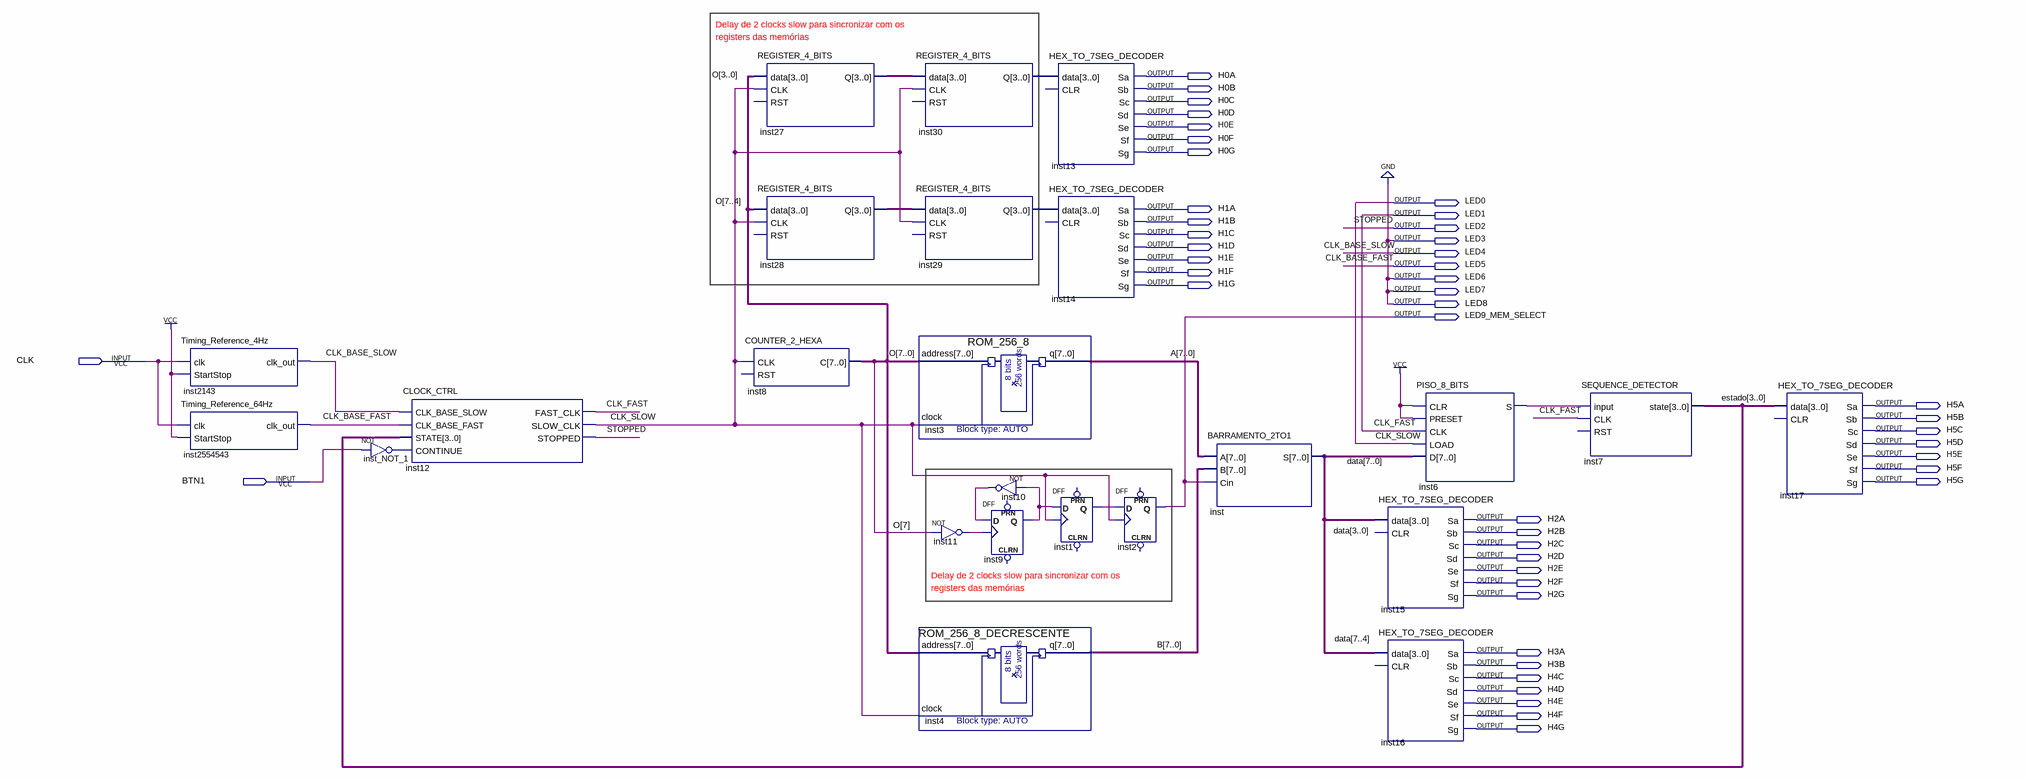
[diagram p0: schematic sheet]
// Quartus schematic main.bdf as structural Verilog: 24 symbols, 47 pins
module main (
  input  CLK,
  input  BTN1,
  output H0A,
  output H0B,
  output H0C,
  output H0D,
  output H0E,
  output H0F,
  output H0G,
  output LED0,
  output H1A,
  output LED1,
  output H1B,
  output LED2,
  output H1C,
  output LED3,
  output H1D,
  output LED4,
  output H1E,
  output LED5,
  output H1F,
  output LED6,
  output H1G,
  output LED7,
  output LED8,
  output LED9_MEM_SELECT,
  output H5A,
  output H5B,
  output H5C,
  output H5D,
  output H5E,
  output H5F,
  output H5G,
  output H2A,
  output H2B,
  output H2C,
  output H2D,
  output H2E,
  output H2F,
  output H2G,
  output H3A,
  output H3B,
  output H4C,
  output H4D,
  output H4E,
  output H4F,
  output H4G
);

  wire inst1_q, inst6_s, inst9_q, inst10_out, inst11_out, inst_NOT_1_out;
  wire [3:0] estado, inst27_q, inst28_q, inst29_q, inst30_q;
  wire [7:0] A, B, data, O;

  Timing_Reference_4Hz inst2143 (.clk(CLK), .StartStop(1'b1), .clk_out(LED4));
  Timing_Reference_64Hz inst2554543 (.clk(CLK), .StartStop(1'b1), .clk_out(LED5));
  CLOCK_CTRL inst12 (
    .CLK_BASE_SLOW(LED4), .CLK_BASE_FAST(LED5), .STATE(estado), .CONTINUE(inst_NOT_1_out), .FAST_CLK(LED1),
    .SLOW_CLK(LED0), .STOPPED(LED2));
  not inst_NOT_1 (inst_NOT_1_out, BTN1);
  REGISTER_4_BITS inst27 (.data(O[3:0]), .CLK(LED0), .Q(inst27_q));  // open: RST
  REGISTER_4_BITS inst28 (.data(O[7:4]), .CLK(LED0), .Q(inst28_q));  // open: RST
  COUNTER_2_HEXA inst8 (.CLK(LED0), .C(O));  // open: RST
  REGISTER_4_BITS inst30 (.data(inst27_q), .CLK(LED0), .Q(inst30_q));  // open: RST
  REGISTER_4_BITS inst29 (.data(inst28_q), .CLK(LED0), .Q(inst29_q));  // open: RST
  ROM_256_8 inst3 (.address(O), .clock(LED0), .q(A));
  not inst11 (inst11_out, O[7]);
  ROM_256_8_DECRESCENTE inst4 (.address(O), .clock(LED0), .q(B));
  not inst10 (inst10_out, inst9_q);
  DFF inst9 (.CLK(inst11_out), .D(inst10_out), .Q(inst9_q));  // open: CLRN, PRN
  HEX_TO_7SEG_DECODER inst13 (
    .data(inst30_q), .Sa(H0A), .Sb(H0B), .Sc(H0C), .Sd(H0D), .Se(H0E), .Sf(H0F), .Sg(H0G));  // open: CLR
  HEX_TO_7SEG_DECODER inst14 (
    .data(inst29_q), .Sa(H1A), .Sb(H1B), .Sc(H1C), .Sd(H1D), .Se(H1E), .Sf(H1F), .Sg(H1G));  // open: CLR
  DFF inst1 (.CLK(LED0), .D(inst9_q), .Q(inst1_q));  // open: CLRN, PRN
  DFF inst2 (.CLK(LED0), .D(inst1_q), .Q(LED9_MEM_SELECT));  // open: CLRN, PRN
  BARRAMENTO_2TO1 inst (.A(A), .B(B), .Cin(LED9_MEM_SELECT), .S(data));
  PISO_8_BITS inst6 (.CLR(1'b1), .PRESET(1'b1), .CLK(LED1), .LOAD(LED0), .D(data), .S(inst6_s));
  HEX_TO_7SEG_DECODER inst15 (
    .data(data[3:0]), .Sa(H2A), .Sb(H2B), .Sc(H2C), .Sd(H2D), .Se(H2E), .Sf(H2F), .Sg(H2G));  // open: CLR
  HEX_TO_7SEG_DECODER inst16 (
    .data(data[7:4]), .Sa(H3A), .Sb(H3B), .Sc(H4C), .Sd(H4D), .Se(H4E), .Sf(H4F), .Sg(H4G));  // open: CLR
  SEQUENCE_DETECTOR inst7 (.\input (inst6_s), .CLK(LED1), .state(estado));  // open: RST
  HEX_TO_7SEG_DECODER inst17 (
    .data(estado), .Sa(H5A), .Sb(H5B), .Sc(H5C), .Sd(H5D), .Se(H5E), .Sf(H5F), .Sg(H5G));  // open: CLR

  assign LED3 = 1'b0;
  assign LED6 = 1'b0;
  assign LED7 = 1'b0;
  assign LED8 = 1'b0;

  // Other names for the same wires on the sheet: CLK_BASE_FAST = LED5; CLK_BASE_SLOW = LED4; CLK_SLOW = LED0;
  //   CLK_FAST = LED1; STOPPED = LED2

  // Notes on the sheet:
  //   Delay de 2 clocks slow para sincronizar com os
  //   registers das memórias
  //   Delay de 2 clocks slow para sincronizar com os
  //   registers das memórias
endmodule
